# Altium schematic sheet 04-USB-TFT.SchDoc
size A4; SheetNumber: 4; SheetTotal: 4
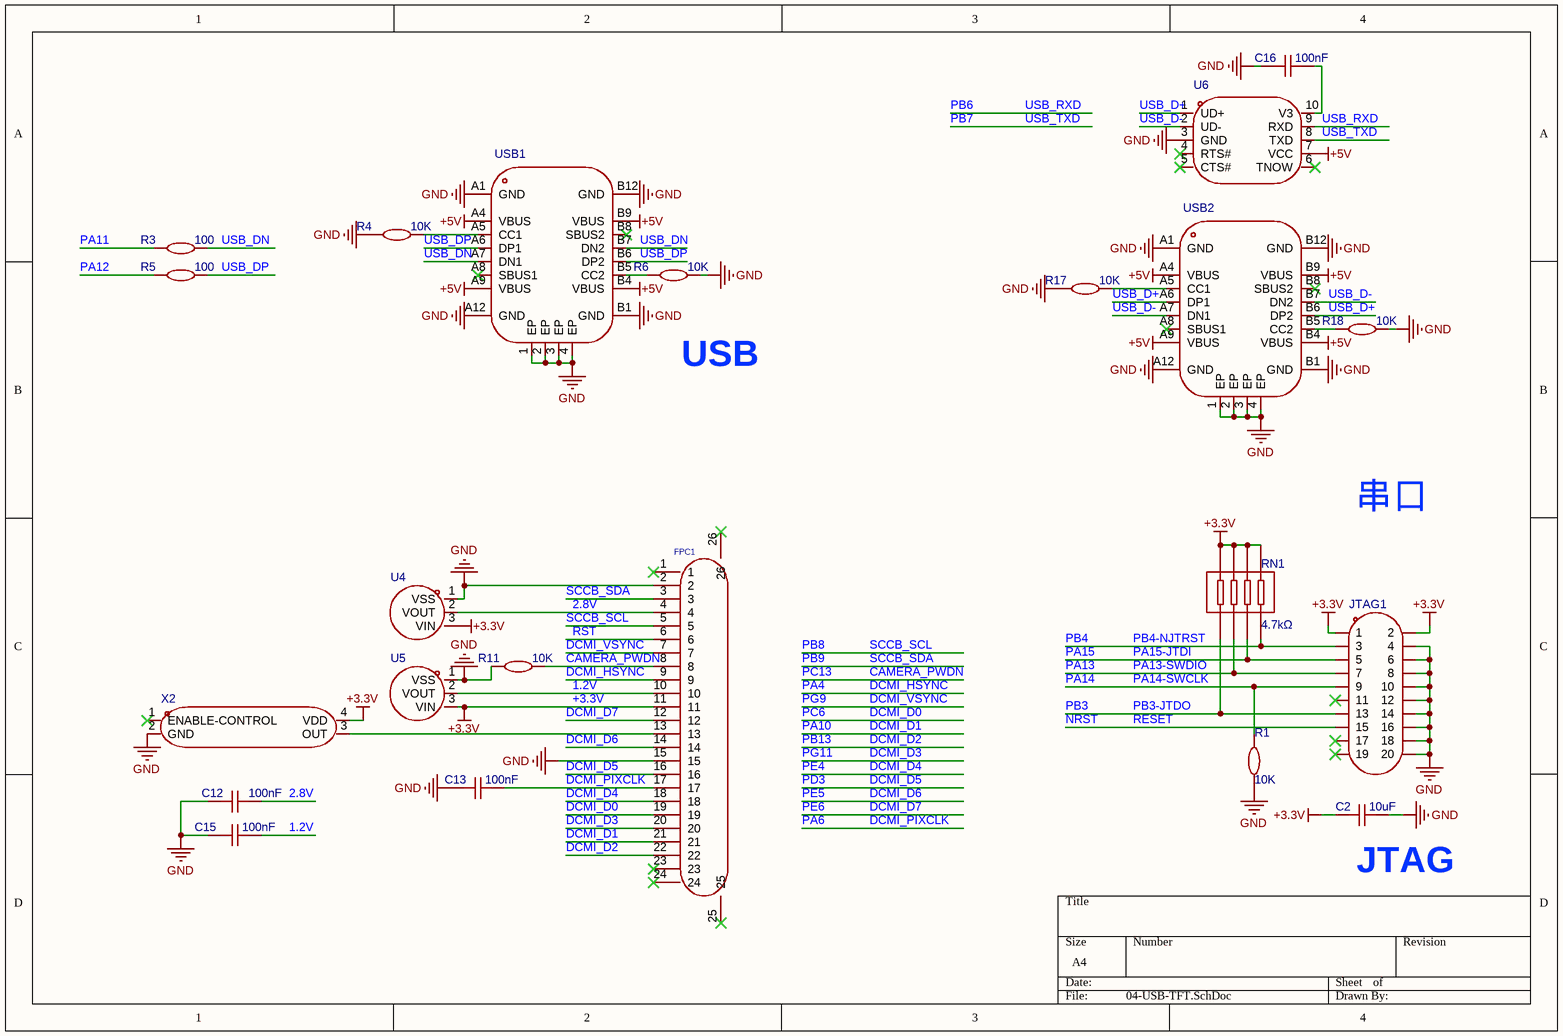
[diagram p0: 04-USB-TFT.SchDoc]

## Parts
C2  value 10uF  [C0603]  (hidden comment: CAP_0603)
C12  value 100nF  [C0603]  (hidden comment: CAP_0603)
C13  value 100nF  [C0603]  (hidden comment: CAP_0603)
C15  value 100nF  [C0603]  (hidden comment: CAP_0603)
C16  value 100nF  [C0603]  (hidden comment: CAP_0603)
FPC1  AFC01-S24FCA-00  [FPC-SMD_P0.50-24P_FGS-XJ-H2.0]  (value not drawn)
JTAG1  IDC-20  [IDC-TH_20P-P2.54-V-R2-C10-S2.54]  (value not drawn)
R1  value 10K  [R0603]  (hidden comment: Res_0603)
R3  value 100  [R0603]  (hidden comment: Res_0603)
R4  value 10K  [R0603]  (hidden comment: Res_0603)
R5  value 100  [R0603]  (hidden comment: Res_0603)
R6  value 10K  [R0603]  (hidden comment: Res_0603)
R11  value 10K  [R0603]  (hidden comment: Res_0603)
R17  value 10K  [R0603]  (hidden comment: Res_0603)
R18  value 10K  [R0603]  (hidden comment: Res_0603)
RN1  value 4.7kΩ  [RES-ARRAY-SMD_0603-8P-L3.2-W1.6-BL]  (hidden comment: 4D03WGJ0472T5E)
U4  XC6206-2.8V  [SOT-23-3_L2.9-W1.6-P1.90-LS2.8-BR]  (value not drawn)
U5  XC6206P122MR-G  [SOT-23-3_L2.9-W1.6-P1.90-LS2.8-BR]  (value not drawn)
U6  CH340E  [MSOP-10_L3.0-W3.0-P0.50-LS5.0-BL]  (value not drawn)
USB1  USB_TYPE-C-16P  [USB_TYPE-C-16P]  (value not drawn)
USB2  USB_TYPE-C-16P  [USB_TYPE-C-16P]  (value not drawn)
X2  12M 有源晶振  [OSC-SMD_4P-L3.2-W2.5-BL]  (value not drawn)

## Nets
+3.3V: C2.1 FPC1.11 JTAG1.1 JTAG1.2 RN1.5 RN1.6 RN1.7 RN1.8 U4.3(VIN) U5.3(VIN) X2.4(VDD)
+5V: U6.7(VCC) USB1.A4(VBUS) USB1.A9(VBUS) USB1.B4(VBUS) USB1.B9(VBUS) USB2.A4(VBUS) USB2.A9(VBUS) USB2.B4(VBUS) USB2.B9(VBUS)
GND: C2.2 C12.1 C13.1 C15.1 C16.2 FPC1.2 FPC1.15 JTAG1.4 JTAG1.6 JTAG1.8 JTAG1.10 JTAG1.12 JTAG1.14 JTAG1.16 JTAG1.18 JTAG1.20 R1.1 R4.1 R6.2 R11.1 R17.1 R18.2 U4.1(VSS) U5.1(VSS) U6.3(GND) USB1.1(EP) USB1.2(EP) USB1.3(EP) USB1.4(EP) USB1.A1(GND) USB1.A12(GND) USB1.B1(GND) USB1.B12(GND) USB2.1(EP) USB2.2(EP) USB2.3(EP) USB2.4(EP) USB2.A1(GND) USB2.A12(GND) USB2.B1(GND) USB2.B12(GND) X2.2(GND)
1.2V: C15.2 FPC1.10 U5.2(VOUT)
2.8V: C12.2 FPC1.4 U4.2(VOUT)
CAMERA_PWDN: FPC1.8 R11.2  [also labelled PC13]
DCMI_D0: FPC1.19  [also labelled PC6]
DCMI_D1: FPC1.21  [also labelled PA10]
DCMI_D2: FPC1.22  [also labelled PB13]
DCMI_D3: FPC1.20  [also labelled PG11]
DCMI_D4: FPC1.18  [also labelled PE4]
DCMI_D5: FPC1.16  [also labelled PD3]
DCMI_D6: FPC1.14  [also labelled PE5]
DCMI_D7: FPC1.12  [also labelled PE6]
DCMI_HSYNC: FPC1.9  [also labelled PA4]
DCMI_PIXCLK: C13.2 FPC1.17  [also labelled PA6]
DCMI_VSYNC: FPC1.7  [also labelled PG9]
NRST: JTAG1.15  [also labelled RESET]
PA11: R3.1
PA12: R5.1
PA13: JTAG1.7 RN1.2  [also labelled PA13-SWDIO]
PA14: JTAG1.9 R1.2  [also labelled PA14-SWCLK]
PA15: JTAG1.5 RN1.3  [also labelled PA15-JTDI]
PB3: JTAG1.13 RN1.1  [also labelled PB3-JTDO]
PB4: JTAG1.3 RN1.4  [also labelled PB4-NJTRST]
PB6: U6.9(RXD)  [also labelled USB_RXD]
PB7: U6.8(TXD)  [also labelled USB_TXD]
PB8: FPC1.5  [also labelled SCCB_SCL]
PB9: FPC1.3  [also labelled SCCB_SDA]
RST: FPC1.6
USB_D+: U6.1(UD+) USB2.A6(DP1) USB2.B6(DP2)
USB_D-: U6.2(UD-) USB2.A7(DN1) USB2.B7(DN2)
USB_DN: R3.2 USB1.A7(DN1) USB1.B7(DN2)
USB_DP: R5.2 USB1.A6(DP1) USB1.B6(DP2)
NetC16_1: C16.1 U6.10(V3)
NetFPC1_13: FPC1.13 X2.3(OUT)
NetR4_2: R4.2 USB1.A5(CC1)
NetR6_1: R6.1 USB1.B5(CC2)
NetR17_2: R17.2 USB2.A5(CC1)
NetR18_1: R18.1 USB2.B5(CC2)

Not connected (* = marked no-connect by the designer): FPC1 1* 23* 24* 25* 26*; JTAG1 11* 17* 19*; U6 4(RTS#)* 5(CTS#)* 6(TNOW)*; USB1 A8(SBUS1)* B8(SBUS2)*; USB2 A8(SBUS1)* B8(SBUS2)*; X2 1(ENABLE-CONTROL)*

## Notes on the sheet
- USB
- 串口
- (near C2) JTAG

## Library data of the parts
C2 C12 C13 C15 C16 = CAP_0603: ConvertToPcb: yes; SymbolName: CapAcitance; ModelId: ac125912035d415993ca9572d50418b1; ModelName: C0603_L1.6-W0.8-H0.8; ModelTransform: 62.992,31.496,0,0,0,0,0,0,0; Device: CAP_0603; AddInBom: yes; Supplier Footprint: 0603; FootprintName: C0603
FPC1 = AFC01-S24FCA-00: 间距:0.5mm;触点数量:24P;锁定特性:翻盖式;安装类型:卧贴;触点类型:下接;; Manufacturer: JS(钜硕电子); AddInBom: yes; ModelId: b219624667974e5eae6427e3a0330768; ModelName: FPC-SMD_P0.50-WS-24P; ModelTransform: 637.794,236.22,0,180,0,0,0.001,57.09,0; Pitch: 0.5mm; Number of Contacts: 24P; Locking Feature: 翻盖式; FFC, FCB Thickness: 0.3mm; Symbol: AFC01-S24FCA-00; Device: AFC01-S24FCA-00; Supplier: LCSC; Supplier Part: C262669; Manufacturer Part: AFC01-S24FCA-00; JLCPCB Part Class: 扩展库; LCSC Part Name: 0.5mm P数:24P 翻盖式 下接; Supplier Footprint: SMD,P=0.5mm; Datasheet: https://atta.szlcsc.com/upload/public/pdf/source/20190816/C413942_2A72D1AC756EAE17EEDF756A339D4500.pdf; ConvertToPcb: yes; FootprintName: FPC-SMD_P0.50-24P_FGS-XJ-H2.0; Mounting Type: 卧贴; Contact Type: 下接; Height Above Board: 2mm
JTAG1 = IDC-20: AddInBom: yes; ModelId: 919cb9b113224b379d0081fecd8b0ef1; ModelTransform: 1299.21,358.267,0,0,0,0,0,5.906,-118.11; Device: IDC-20; ConvertToPcb: yes; SymbolName: IDC-20; LCSC Part Name: IDC-20; SupplierPart: C9900015890; ManufacturerPart: IDC-20; Supplier Footprint: JTAG; JLCPCB Part Class: ExtendedPart; Datasheet: https://atta.szlcsc.comnull; Supplier: LCSC; ModelName: IDC-TH_20P-P2.54-V-R2-C10-S2.54; FootprintName: IDC-TH_20P-P2.54-V-R2-C10-S2.54
R1 R3-R6 R11 R17 R18 = Res_0603: Symbol: 电阻; ConvertToPcb: yes; ModelId: fc143cca1e79419f9cd78b61e9279f08; ModelTransform: 31.8897,63.7794,0,90,0,0,0,0,0; Device: Res_0603; AddInBom: yes; Supplier Footprint: 0603; FootprintName: R0603; ModelName: R0603
RN1 = 4D03WGJ0472T5E: 阻值:4.7kΩ;精度:±5%;单个元件功率:62.5mW;电阻器数:4;温度系数:±200ppm/℃;; Manufacturer: UNI-ROYAL(厚声); AddInBom: yes; ModelId: edf39f9a2dca4b9a94267f442dd4f95a; ModelName: R0603-8P_L3.2-W1.6-H0.6; ModelTransform: 125.984,62.992,0,0,0,0,0,0,0; Tolerance: ±5%; Power(Watts): 62.5mW; Number of Resistors: 4; Symbol: 4D03WGJ0472T5E; Device: 4D03WGJ0472T5E; Supplier: LCSC; Manufacturer Part: 4D03WGJ0472T5E; Supplier Part: C1980; JLCPCB Part Class: 基础库; LCSC Part Name: 4.7kΩ ±5%; Supplier Footprint: 0603x4; Datasheet: https://atta.szlcsc.com/upload/public/pdf/source/20191224/C474318_2527498AE30E813171187CCD28401A71.pdf; ConvertToPcb: yes; FootprintName: RES-ARRAY-SMD_0603-8P-L3.2-W1.6-BL; Number of Pins: 8; Temperature Coefficient: ±200ppm/℃
U4 = XC6206-2.8V: 输出类型:固定;输出极性:正;最大输入电压:6V;输出电压:2.8V;输出电流:250mA;; Manufacturer: YONGYUTAI(永裕泰); AddInBom: yes; ModelId: 89cb27a44ab2466697082bb9fd73a7d0; ModelName: SOT-23-3L_L2.9-W1.6-H1.1-LS2.8-P0.95; ModelTransform: 110.236,114.173,0,180,0,0,-0.005,0.0005,0; Output Type: 固定; Output Polarity: 正; Number of Outputs: 1; Maximum Input Voltage: 6V; Output Voltage: 2.8V; Output Current: 250mA; Symbol: XC6206-2.8V; Device: XC6206-2.8V; LCSC Part Name: XC6206-2.8V; SupplierPart: C2892669; ManufacturerPart: XC6206-2.8V; Supplier Footprint: SOT-23-3L; JLCPCB Part Class: 扩展库; Datasheet: https://atta.szlcsc.com/upload/public/pdf/source/20210901/DE3C77F0CE73FFE8F7C655BE9B94CB06.pdf; Supplier: LCSC; ConvertToPcb: yes; FootprintName: SOT-23-3_L2.9-W1.6-P1.90-LS2.8-BR; Operating Temperature: -40℃~+85℃@(Tj)
U5 = XC6206P122MR-G: 输出类型:固定;输出极性:正;最大输入电压:7V;输出电压:1.2V~1.2V;输出电流:60mA;电源纹波抑制比(PSRR):-;; Manufacturer: TOREX(特瑞仕); AddInBom: yes; ModelId: 89cb27a44ab2466697082bb9fd73a7d0; ModelName: SOT-23-3L_L2.9-W1.6-H1.1-LS2.8-P0.95; ModelTransform: 110.236,114.173,0,180,0,0,-0.005,0.0005,0; Output Type: 固定; Output Polarity: 正; Number of Outputs: 1; Maximum Input Voltage: 7V; Dropout Voltage: 960mV@(60mA); Output Current: 60mA; Symbol: XC6206P122MR-G; Device: XC6206P122MR-G; LCSC Part Name: XC6206P122MR-G; SupplierPart: C424699; ManufacturerPart: XC6206P122MR-G; Supplier Footprint: SOT-23; JLCPCB Part Class: 扩展库; Datasheet: https://atta.szlcsc.com/upload/public/pdf/source/20190903/C424699_59FCC169C113A8B3272904318A708AFC.pdf; Supplier: LCSC; ConvertToPcb: yes; FootprintName: SOT-23-3_L2.9-W1.6-P1.90-LS2.8-BR; Output Voltage: 1.2V~1.2V; Power Supply Rejection Ratio (PSRR): -
U6 = CH340E: 应用功能:收发器;接口协议:USB 2.0;数据速率:2Mbps;; Manufacturer: WCH(南京沁恒); AddInBom: yes; ModelId: b42a31f9e1fa4643bc7ea573b9bba7ed; ModelName: MSOP-10_L3.0-W3.0-H1.1-LS5.0-P0.50; ModelTransform: 118.11,196.85,0,0,0,0,0,0,0; Applications Function: 收发器; Protocol: USB 2.0; Data Rate: 2Mbps; Supply Voltage: 3.3V；5V; Symbol: CH340E; Device: CH340E; Supplier: LCSC; Manufacturer Part: CH340E; Supplier Part: C99652; JLCPCB Part Class: 扩展库; LCSC Part Name: USB转串口芯片 CH340; Supplier Footprint: MSOP-10; Datasheet: https://atta.szlcsc.com/upload/public/pdf/source/20230530/6E401E9554E9F5311886CC8B3F89B62E.pdf; ConvertToPcb: yes; FootprintName: MSOP-10_L3.0-W3.0-P0.50-LS5.0-BL
USB1 USB2 = USB_TYPE-C-16P: AddInBom: yes; ModelId: 35058e297fd54ee2afd2de30c3ce7155; ModelName: USB-C_SMD-TYPE-C-31-M-12; ModelTransform: 360,318.121,0,180,0,0,0,-41.02,-39.37; Device: USB_TYPE-C-16P; Supplier Footprint: SMD; ConvertToPcb: yes; SymbolName: USB_TYPE-C-16P; FootprintName: USB_TYPE-C-16P
X2 = 12M 有源晶振: AddInBom: yes; ModelId: ae22b8d143894765bc8100c37cb6356f; ModelName: OSC-SMD_4P-L3.2-W2.5-H1.0; ModelTransform: 125.984,98.425,0,0,0,0,0,0,0; Symbol: 12M 有源晶振; Device: 12M 有源晶振; LCSC Part Name: 12M 有源晶振; SupplierPart: C9900018362; ManufacturerPart: 12M 有源晶振; Supplier Footprint: SMD3225; JLCPCB Part Class: 扩展库; Datasheet: https://atta.szlcsc.comnull; Supplier: LCSC; ConvertToPcb: yes; FootprintName: OSC-SMD_4P-L3.2-W2.5-BL